# EAGLE design Group Project PCB Updated (EAGLE 9.6.2)
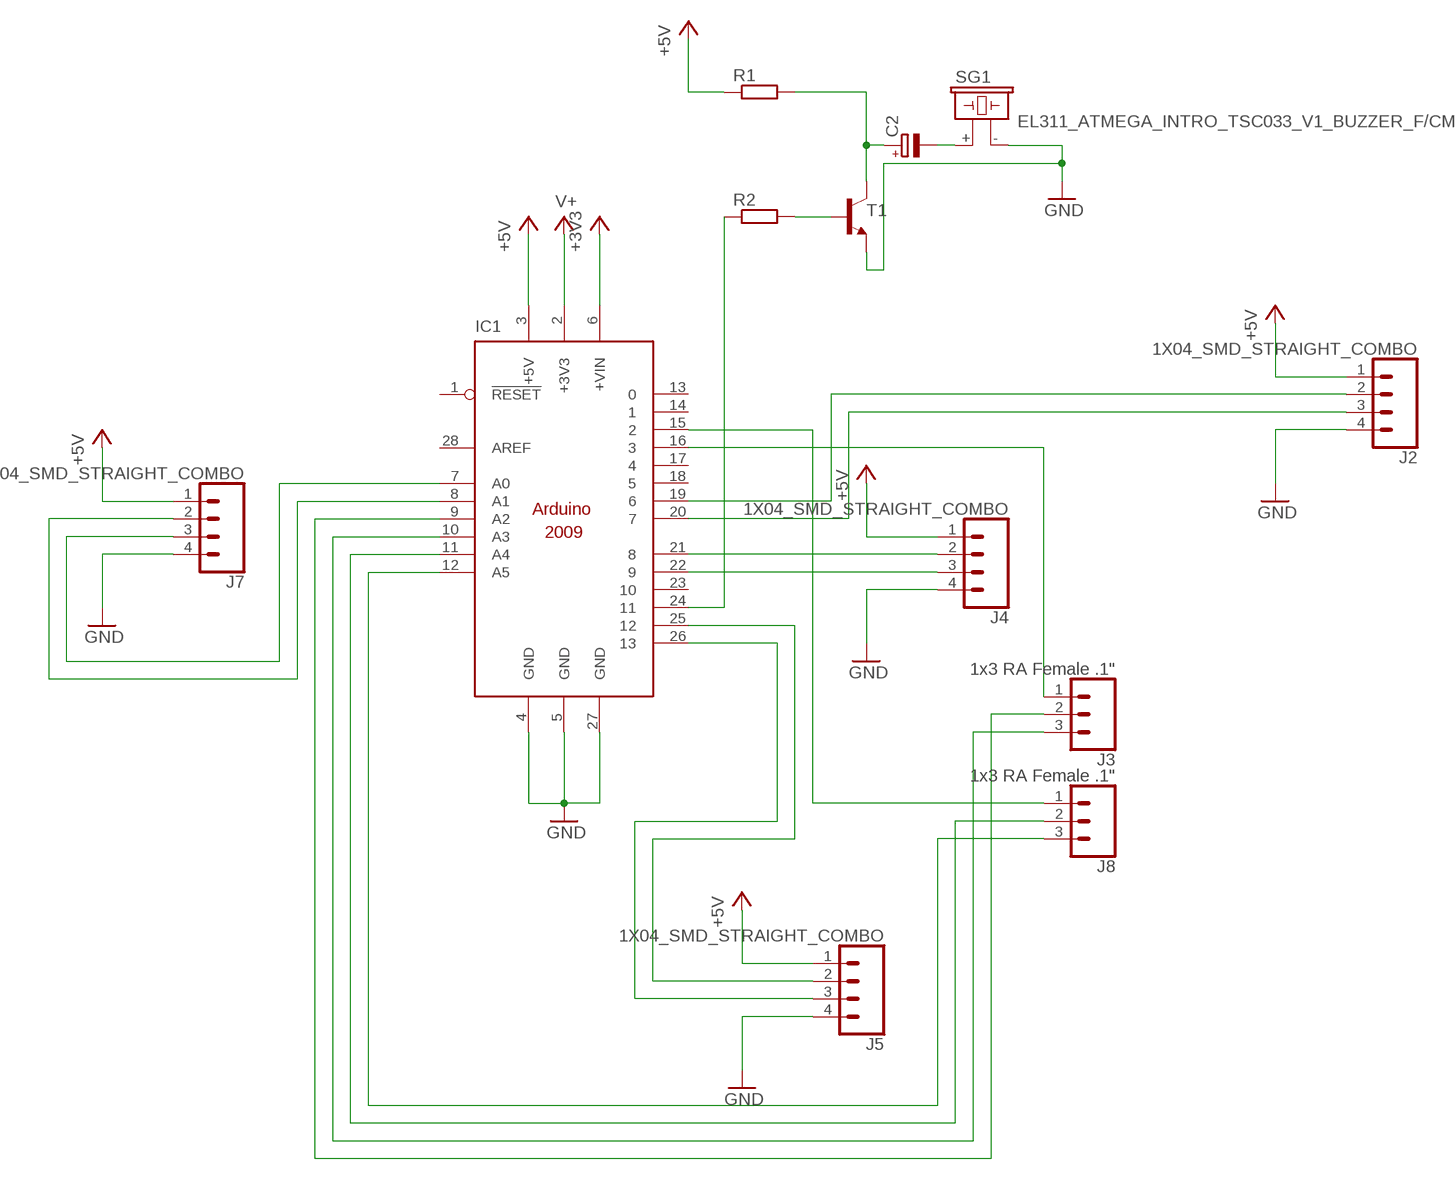
[diagram p0: schematic, sheet 1]

## Parts
C2  RCL_CPOL-EUE3.5-8  [ELECTROLYTIC_CAP_RCL_E3,5-8]
IC1  ARDUINO2009_10  [ARDUINO2009]
J2  1X04_SMD_STRAIGHT_COMBO  CONN_04LONGPADS  [1X04_LONGPADS]
J3  1x3 RA Female .1"  CONN_03LONGPADS  [1X03_LONGPADS]
J4  1X04_SMD_STRAIGHT_COMBO  CONN_04LONGPADS  [1X04_LONGPADS]
J5  1X04_SMD_STRAIGHT_COMBO  CONN_04LONGPADS  [1X04_LONGPADS]
J7  1X04_SMD_STRAIGHT_COMBO  CONN_04LONGPADS  [1X04_LONGPADS]
J8  1x3 RA Female .1"  CONN_03LONGPADS  [1X03_LONGPADS]
R1  R-EU_0207/10  [0207/10]
R2  R-EU_0207/10  [0207/10]
SG1  EL311_ATMEGA_INTRO_TSC033_V1_BUZZER_F/CM12P  [EL311_ATMEGA_INTRO_TSC033_V1_BUZZER_F/CM12P]
T1  2N1613-NPN-TO92-EBC  [TO92-EBC]

## Nets
+3V3: IC1.6(+VIN)
+5V: IC1.3(+5V) J2.1 J4.1 J5.1 J7.1 R1.1
GND: IC1.4(GND) IC1.5(GND) IC1.27(GND) J2.4 J4.4 J5.4 J7.4 SG1.- T1.E
N$1: R2.2 T1.B
N$2: C2.- SG1.+
N$3: IC1.21 J4.2
N$4: IC1.22 J4.3
N$5: IC1.19 J2.2
N$6: IC1.20 J2.3
N$7: IC1.8(A1) J7.2
N$8: IC1.7(A0) J7.3
N$9: IC1.25 J5.2
N$10: IC1.26 J5.3
N$11: C2.+ R1.2 T1.C
N$12: IC1.15 J8.1
N$13: IC1.16 J3.1
N$14: IC1.24 R2.1
N$15: IC1.9(A2) J3.2
N$16: IC1.11(A4) J8.2
N$17: IC1.10(A3) J3.3
N$18: IC1.12(A5) J8.3
V+: IC1.2(+3V3)
Unconnected: IC1.1(!RESET) IC1.13 IC1.14 IC1.17 IC1.18 IC1.23 IC1.28(AREF)

## Library data of the parts
C2 = EENG3110 V1 Library:RCL_CPOL-EU: POLARIZED CAPACITOR, European symbol
IC1 = arduino:ARDUINO2009_1: The Arduino Duemilanove ("2009") is a microcontroller board based on the ATmega168 or ATmega328. - 14 digital input/output pins (of which 6 can be used as PWM outputs) - 6 analog inputs, a 16 MHz crystal oscillator - USB connection - power jack - ISP header - reset button It contains everything needed to support the microcontroller; simply connect it to a computer with a USB cable or power it with a AC-to-DC adapter or battery to get started http://arduino.cc/en/Main/ArduinoBoardDuemilanove
J2 J4 J5 J7 = EENG3110 V1 Library:CONN_04: Multi connection point. Often used as Generic Header-pin footprint for 0.1 inch spaced/style header connections On any of the 0.1 inch spaced packages, you can populate with these: Break Away Headers - Straight <https://www.sparkfun.com/products/116> (PRT-00116) Break Away Male Headers - Right Angle <https://www.sparkfun.com/products/553> (PRT-00553) Female Headers <https://www.sparkfun.com/products/115> (PRT-00115) Break Away Headers - Machine Pin <https://www.sparkfun.com/products/117> (PRT-00117) Break Away Female Headers - Swiss Machine Pin <https://www.sparkfun.com/products/743> (PRT-00743) For SCREWTERMINALS and SPRING TERMINALS visit here: Screw Terimnals on SparkFun.com <https://www.sparkfun.com/search/results?term=Screw+Terminals> (5mm/3.5mm/2.54mm spacing) This device is also useful as a general connection point to wire up your design to another part of your project. Our various solder wires solder well into these plated through hole pads. Hook-Up Wire - Assortment (Stranded, 22 AWG) <https://www.sparkfun.com/products/11375> (PRT-11375) Hook-Up Wire - Assortment (Solid Core, 22 AWG) <https://www.sparkfun.com/products/11367> (PRT-11367) View the entire wire category on our website here <https://www.sparkfun.com/categories/141> Special notes: Molex polarized connector foot print use with SKU : PRT-08231 with associated crimp pins and housings. 1MM SMD Version SKU: PRT-10208; PROD_ID: CONN-08511; SF_ID: PRT-12638
J3 J8 = EENG3110 V1 Library:CONN_03: Multi connection point. Often used as Generic Header-pin footprint for 0.1 inch spaced/style header connections On any of the 0.1 inch spaced packages, you can populate with these: Break Away Headers - Straight <https://www.sparkfun.com/products/116> (PRT-00116) Break Away Male Headers - Right Angle <https://www.sparkfun.com/products/553> (PRT-00553) Female Headers <https://www.sparkfun.com/products/115> (PRT-00115) Break Away Headers - Machine Pin <https://www.sparkfun.com/products/117> (PRT-00117) Break Away Female Headers - Swiss Machine Pin <https://www.sparkfun.com/products/743> (PRT-00743) Stackable Header - 3 Pin (Female, 0.1") <https://www.sparkfun.com/products/13875> (PRT-13875) For SCREWTERMINALS and SPRING TERMINALS visit here: Screw Terimnals on SparkFun.com <https://www.sparkfun.com/search/results?term=Screw+Terminals> (5mm/3.5mm/2.54mm spacing) This device is also useful as a general connection point to wire up your design to another part of your project. Our various solder wires solder well into these plated through hole pads. Hook-Up Wire - Assortment (Stranded, 22 AWG) <https://www.sparkfun.com/products/11375> (PRT-11375) Hook-Up Wire - Assortment (Solid Core, 22 AWG) <https://www.sparkfun.com/products/11367> (PRT-11367) View the entire wire category on our website here <https://www.sparkfun.com/categories/141> Special notes: Molex polarized connector foot print use with SKU : PRT-08232 with associated crimp pins and housings.; PROD_ID: CONN-10925; SF_ID: PRT-08235; SF_SKU: PRT-08433
R1 R2 = EENG3110 V1 Library:R-EU_: RESISTOR, European symbol
SG1 = EENG3110 V1 Library:EL311_ATMEGA_INTRO_TSC033_V1_BUZZER_F/CM12P: BUZZER Source: Buerklin; OC_FARNELL: unknown; OC_NEWARK: unknown
T1 = EENG3110 V1 Library:*-NPN-: NPN Transistror

## Board
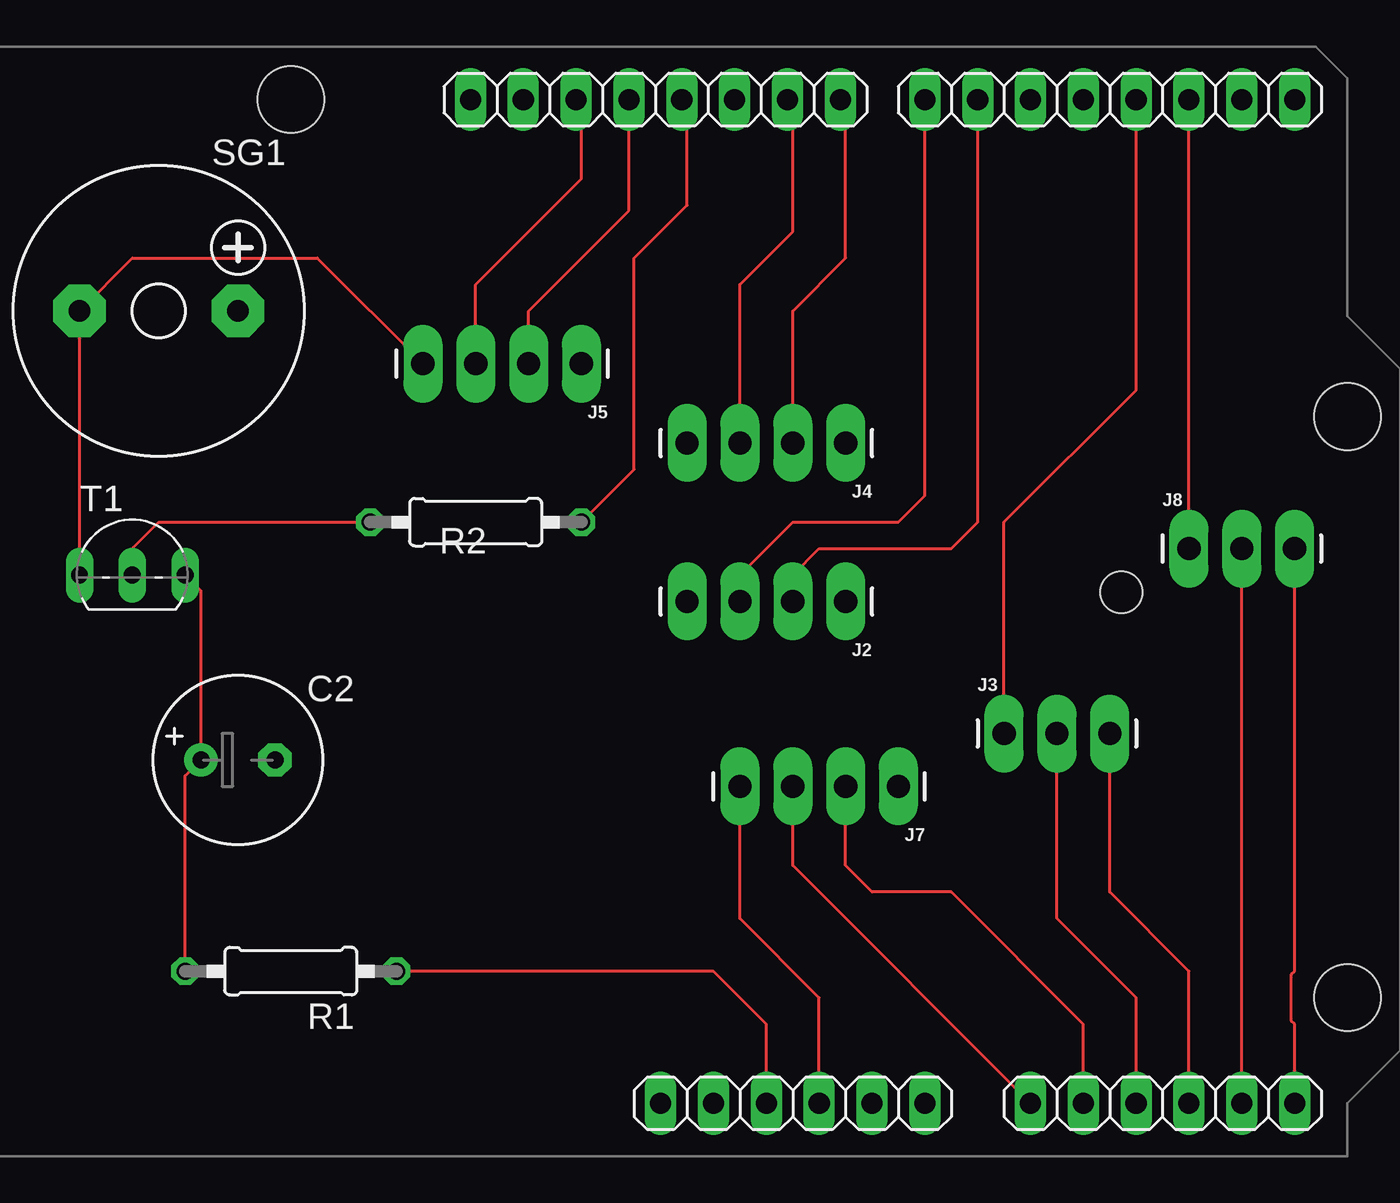
[diagram p1: board, top side]
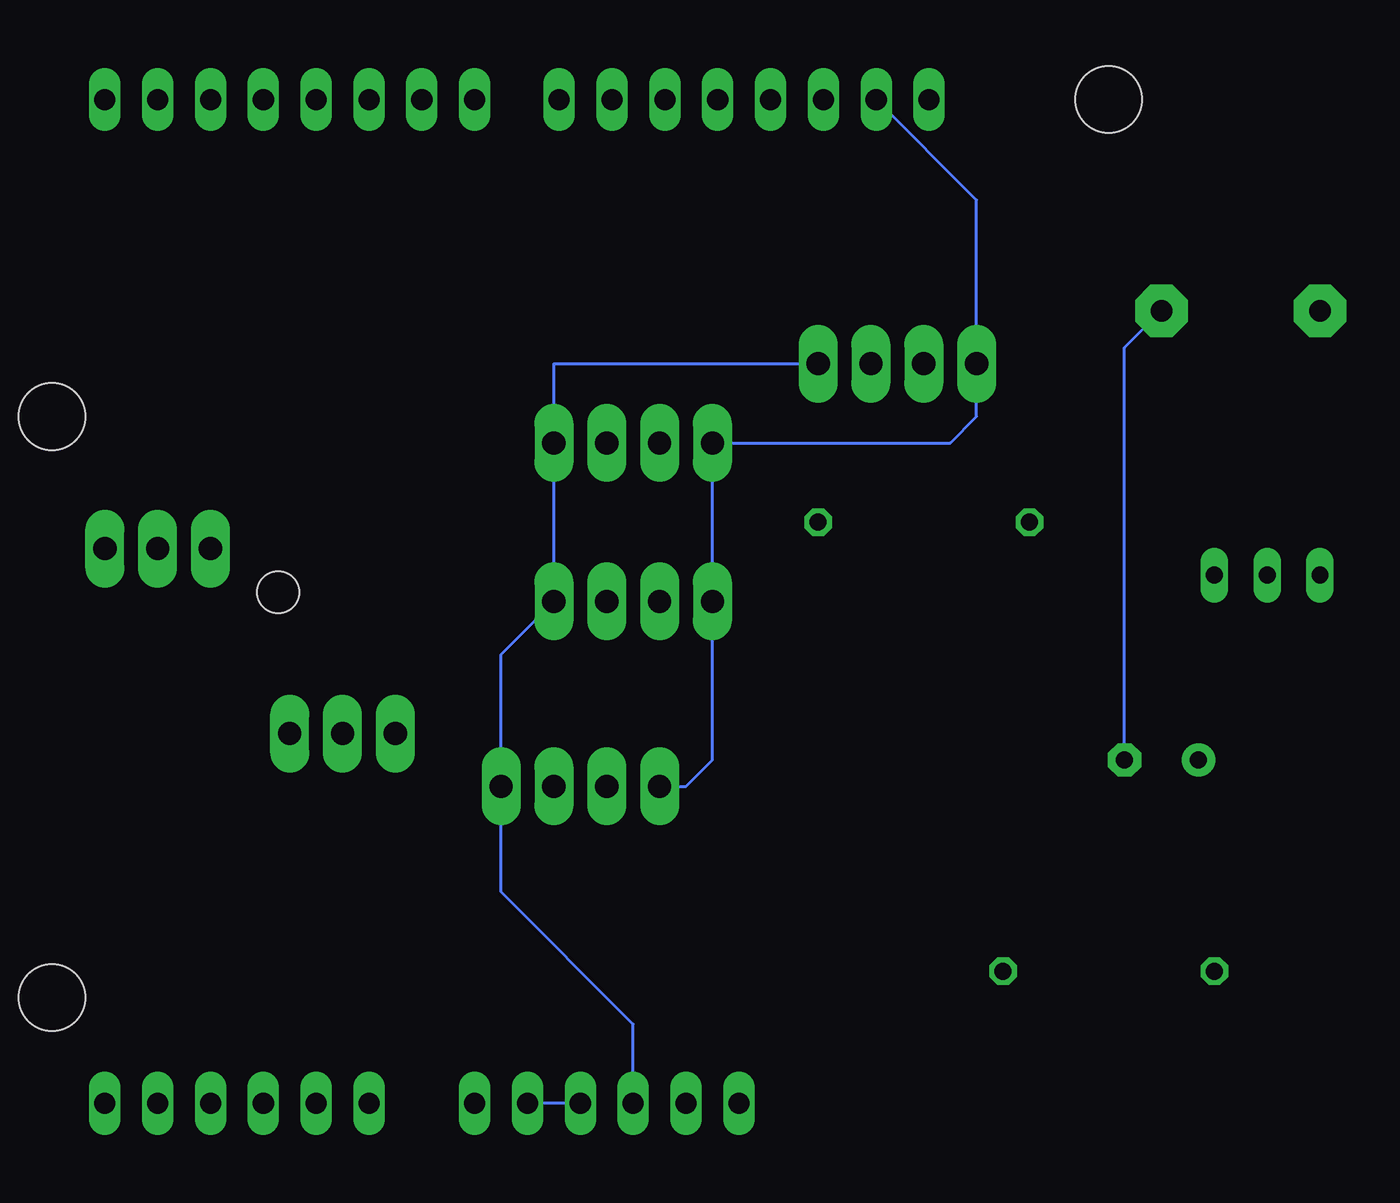
[diagram p2: board, bottom side, seen from below]

No outline drawn. Coordinates in mm, seen from the top.
Copper layers (1*16): Top 0.035mm / dielectric 1.5mm / Bottom 0.035mm
Design rules "default": minimum track width 6mil, minimum drill 0.35mm, track to track 6mil, track to pad 6mil, pad to pad 6mil, via to via 6mil, smd to smd 6mil, copper to edge 40mil, drill to drill 6mil, minimum pad ring 10mil, minimum via ring 8mil, stop-mask expansion 4mil, vias tented up to drill 0mil, thermal gap 10mil

### Footprints (pad centres in the part's own frame; a part is rotated, then mirrored left to right if it is on the bottom)
ELECTROLYTIC_CAP_RCL_E3,5-8 = drill 0.813 pad 1.6: + -1.778,0 | drill 0.813 pad 1.6 octagon: - 1.778,0
ARDUINO2009 = drill 1.016 long: 1 33.02,2.54; 2 35.56,2.54; 3 38.1,2.54; 4 40.64,2.54; 5 43.18,2.54; 6 45.72,2.54; 7 50.8,2.54; 8 53.34,2.54; 9 55.88,2.54; 10 58.42,2.54; 11 60.96,2.54; 12 63.5,2.54; 13 63.5,50.8; 14 60.96,50.8; 15 58.42,50.8; 16 55.88,50.8; 17 53.34,50.8; 18 50.8,50.8; 19 48.26,50.8; 20 45.72,50.8; 21 41.656,50.8; 22 39.116,50.8; 23 36.576,50.8; 24 34.036,50.8; 25 31.496,50.8; 26 28.956,50.8; 27 26.416,50.8; 28 23.876,50.8 | hole 3.2: 15.24,50.8; 66.04,35.56; 66.04,7.62 | hole 2: 55.17,27.114
1X04_LONGPADS = drill 1.118 pad 1.88 long: 1 0,0; 2 2.54,0; 3 5.08,0; 4 7.62,0
1X03_LONGPADS = drill 1.118 pad 1.88 long: 1 0,0; 2 2.54,0; 3 5.08,0
0207/10 = drill 0.813 octagon: 1 -5.08,0; 2 5.08,0
EL311_ATMEGA_INTRO_TSC033_V1_BUZZER_F/CM12P = drill 1.016 pad 2.54 octagon: + 3.81,0; - -3.81,0
TO92-EBC = drill 0.813 long: B 0,-1.27; C 2.54,-1.27; E -2.54,-1.27

### Placement (x,y rotation side)
C2  1.27,-48.26 0 top
IC1  -11.43,-67.31 0 top
J2  30.48,-40.64 180 top
J3  38.1,-46.99 0 top
J4  30.48,-33.02 180 top
J5  17.78,-29.21 180 top
J7  33.02,-49.53 180 top
J8  46.99,-38.1 0 top
R1  3.81,-58.42 180 top
R2  12.7,-36.83 180 top
SG1  -2.54,-26.67 0 top
T1  -3.81,-38.1 0 top

### Tracks (layer width: path | path; a pad name or v marks a point on that pad's centre or on a via)
+5V
  Top 0.152: IC1.3 26.67,-60.96 24.13,-58.42 R1.1
  Bottom 0.152: IC1.3 26.67,-60.96 33.02,-54.61 J7.1 33.02,-43.18 J2.1 J4.1 30.48,-29.21 J5.1
GND
  Top 0.152: J7.4 25.4,-55.88 29.21,-59.69 IC1.4 | T1.E SG1.- -3.81,-24.13 5.08,-24.13 J5.4
  Bottom 0.152: IC1.27 10.16,-21.34 J5.4 10.16,-31.75 11.43,-33.02 J4.4 J2.4 22.86,-48.26 24.13,-49.53 J7.4 | IC1.4 IC1.5
N$1
  Top 0.152: T1.B -3.81,-38.1 -2.54,-36.83 R2.2
N$2
  Bottom 0.152: C2.- 3.05,-28.45 SG1.+
N$3
  Top 0.152: J4.2 27.94,-26.67 30.48,-24.13 30.48,-16.76 IC1.21
N$4
  Top 0.152: J4.3 25.4,-25.4 27.94,-22.86 27.94,-16.76 IC1.22
N$5
  Top 0.152: J2.2 27.94,-39.37 29.21,-38.1 35.56,-38.1 36.83,-36.83 IC1.19
N$6
  Top 0.152: J2.3 25.4,-39.37 27.94,-36.83 33.02,-36.83 34.29,-35.56 IC1.20
N$7
  Top 0.152: IC1.8 41.91,-60.96 35.56,-54.61 31.75,-54.61 30.48,-53.34 J7.2
N$8
  Top 0.152: IC1.7 27.94,-53.34 J7.3
N$9
  Top 0.152: J5.2 15.24,-26.67 20.07,-21.84 IC1.25
N$10
  Top 0.152: J5.3 12.7,-25.4 17.78,-20.32 17.78,-16.76 IC1.26
N$11
  Top 0.152: R1.2 -1.27,-49.02 C2.+ -0.51,-40.13 T1.C
N$12
  Top 0.152: J8.1 IC1.15
N$13
  Top 0.152: J3.1 38.1,-36.83 44.45,-30.48 IC1.16
N$14
  Top 0.152: R2.1 20.32,-34.29 20.32,-24.13 22.86,-21.59 22.86,-16.76 IC1.24
N$15
  Top 0.152: J3.2 40.64,-55.88 44.45,-59.69 IC1.9
N$16
  Top 0.152: IC1.11 J8.2
N$17
  Top 0.152: IC1.10 46.99,-58.42 43.18,-54.61 J3.3
N$18
  Top 0.152: IC1.12 52.07,-60.96 51.92,-60.8 51.92,-58.58 52.07,-58.42 J8.3